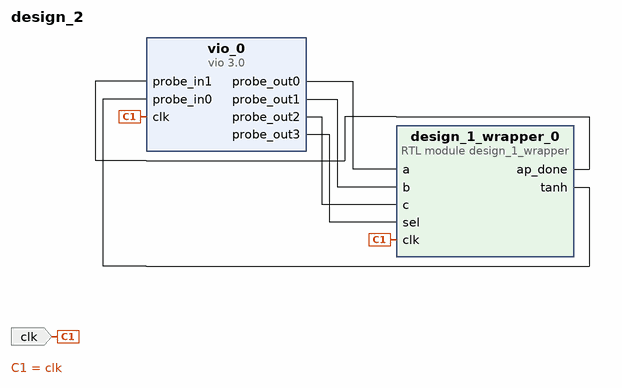
[diagram p0: block diagram of the top level]
# Vivado block design design_2, xc7a35tcpg236-1, Vivado 2022.2
create_bd_design design_2

create_bd_port -dir I clk

create_bd_cell -type ip -vlnv xilinx.com:ip:vio:3.0 vio_0
set_property -dict [list \
  CONFIG.C_NUM_PROBE_IN 2 \
  CONFIG.C_NUM_PROBE_OUT 4 \
  CONFIG.C_PROBE_OUT0_WIDTH 9 \
  CONFIG.C_PROBE_OUT1_WIDTH 9 \
  CONFIG.C_PROBE_OUT2_WIDTH 16 \
] [get_bd_cells vio_0]
create_bd_cell -type module -reference design_1_wrapper design_1_wrapper_0

# ---- connections ----

connect_bd_net [get_bd_ports clk] [get_bd_pins vio_0/clk] [get_bd_pins design_1_wrapper_0/clk]
connect_bd_net [get_bd_pins design_1_wrapper_0/ap_done] [get_bd_pins vio_0/probe_in1]
connect_bd_net [get_bd_pins design_1_wrapper_0/tanh] [get_bd_pins vio_0/probe_in0]
connect_bd_net [get_bd_pins vio_0/probe_out0] [get_bd_pins design_1_wrapper_0/a]
connect_bd_net [get_bd_pins vio_0/probe_out1] [get_bd_pins design_1_wrapper_0/b]
connect_bd_net [get_bd_pins vio_0/probe_out2] [get_bd_pins design_1_wrapper_0/c]
connect_bd_net [get_bd_pins vio_0/probe_out3] [get_bd_pins design_1_wrapper_0/sel]

validate_bd_design
save_bd_design
